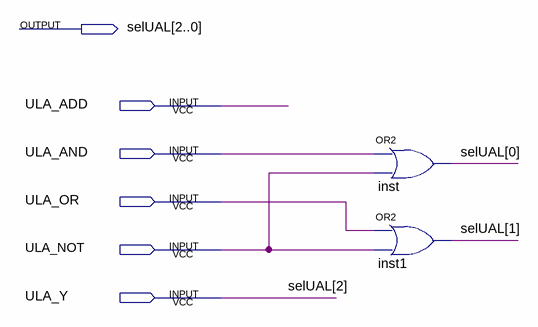
[diagram p0: schematic sheet]
// Quartus schematic Encoder_ULA.bdf as structural Verilog: 2 symbols, 6 pins
module Encoder_ULA (
  input  ULA_ADD,
  input  ULA_AND,
  input  ULA_OR,
  input  ULA_NOT,
  input  ULA_Y,
  output [2:0] selUAL
);

  or inst (selUAL[0], ULA_AND, ULA_NOT);
  or inst1 (selUAL[1], ULA_OR, ULA_NOT);

  assign selUAL[2] = ULA_Y;
endmodule
